# Altium schematic sheet SeptinaryAI_Balldi__elec_mother_board__mother_board_2023-07-21.schdoc
size 426 x 288 mm
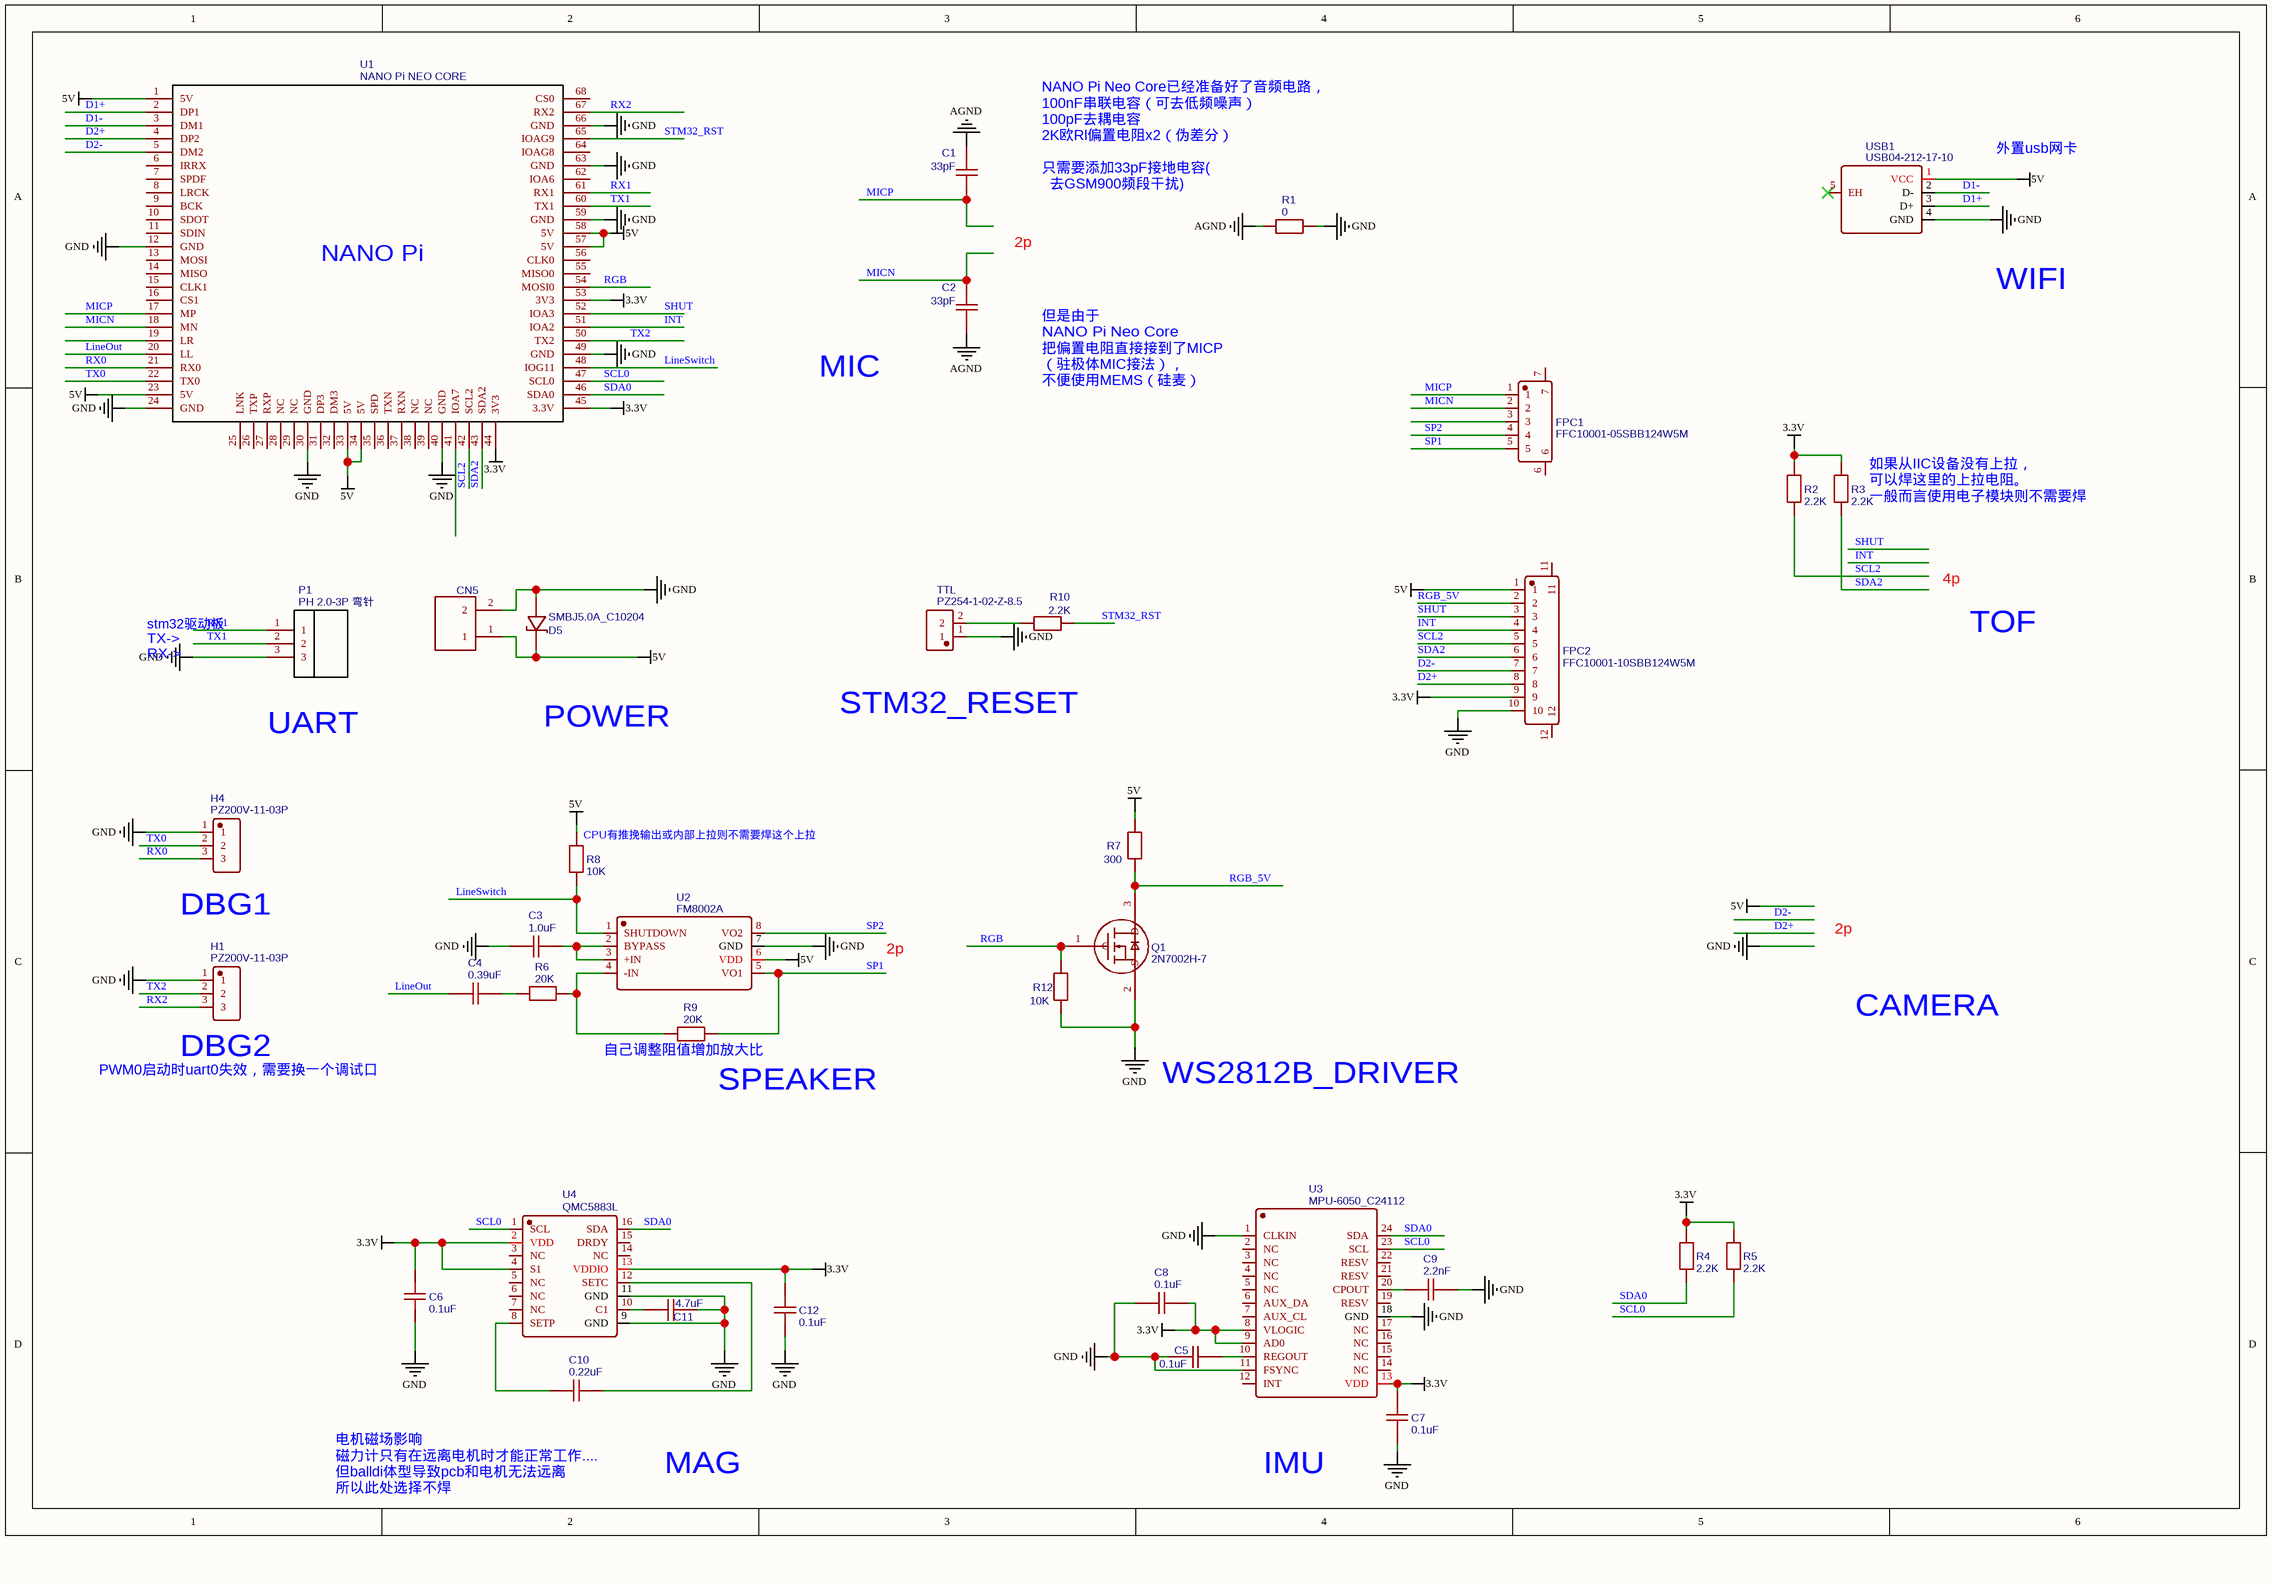
[diagram p0: SeptinaryAI_Balldi__elec_mother_board__mother_board_2023-07-21.schdoc]

## Parts
C1  33pF  [C0603]
C2  33pF  [C0603]
C3  1.0uF  [C0603]
C4  0.39uF  [C0603]
C5  0.1uF  [C0603]
C6  0.1uF  [C0603]
C7  0.1uF  [C0603]
C8  0.1uF  [C0603]
C9  2.2nF  [C0603]
C10  0.22uF  [C0603]
C11  4.7uF  [C0603]
C12  0.1uF  [C0603]
CN5  640454-2  [CONN-TH_640454-2]  (value not drawn)
D5  SMBJ5.0A_C10204  [SMB_L4.6-W3.6-LS5.3-R-RD]
FPC1  FFC10001-05SBB124W5M  [FFC-SMD_FFC10001-05SBB124W5M]
FPC2  FFC10001-10SBB124W5M  [FFC-SMD_FFC10001-10SBB124W5M]
H1  PZ200V-11-03P  [HDR-TH_3P-P2.00-V-M]
H4  PZ200V-11-03P  [HDR-TH_3P-P2.00-V-M]
P1  PH 2.0-3P 弯针  [PH 2.0-3P]
Q1  2N7002H-7  [SOT-23_L2.9-W1.3-P1.90-LS2.4-BR]
R1  0  [MY_R0603]
R2  2.2K  [MY_R0603]
R3  2.2K  [MY_R0603]
R4  2.2K  [MY_R0603]
R5  2.2K  [MY_R0603]
R6  20K  [MY_R0603]
R7  300  [MY_R0603]
R8  10K  [MY_R0603]
R9  20K  [MY_R0603]
R10  2.2K  [MY_R0603]
R12  10K  [MY_R0603]
TTL  PZ254-1-02-Z-8.5  [HDR-TH_2P-P2.54-V-M]
U1  NANO Pi NEO CORE  [NANO_PI_MOD]
U2  FM8002A  [SOP-8_L4.9-W3.9-P1.27-LS6.0-BL]
U3  MPU-6050_C24112  [LGA-24_L4.0-W4.0-P0.50-BL]
U4  QMC5883L  [MY_LGA-16_L3.0-W3.0-P0.50-BL_SQ]
USB1  USB04-212-17-10  [USB-A-TH_USB04-212-17-10B]

## Nets
3.3V: C6.1 C7.1 C8.2 C12.1 FPC2.9 R2.1 R3.1 R4.1 R5.1 U1.44(3V3) U1.45(3.3V) U1.53(3V3) U3.8(VLOGIC) U3.9(AD0) U3.13(VDD) U4.2(VDD) U4.4(S1) U4.13(VDDIO)
5V: CN5.1 D5.2(K) FPC2.1 R7.1 R8.2 U1.1(5V) U1.23(5V) U1.33(5V) U1.34(5V) U1.57(5V) U1.58(5V) U2.6(VDD) USB1.1(VCC)
AGND: C1.2 C2.1 R1.1
GND: C3.2 C5.2 C6.2 C7.2 C8.1 C9.2 C11.2 C12.2 CN5.2 D5.1(A) FPC2.10 H1.1 H4.1 P1.3 Q1.2(S) R1.2 R12.2 TTL.1 U1.12(GND) U1.24(GND) U1.30(GND) U1.40(GND) U1.49(GND) U1.59(GND) U1.63(GND) U1.66(GND) U2.7(GND) U3.1(CLKIN) U3.11(FSYNC) U3.18(GND) U4.9(GND) U4.11(GND) USB1.4(GND)
D1+: U1.2(DP1) USB1.3(D+)
D1-: U1.3(DM1) USB1.2(D-)
D2+: FPC2.8 U1.4(DP2)
D2-: FPC2.7 U1.5(DM2)
INT: FPC2.4 U1.51(IOA2)
LineOut: C4.2 U1.20(LL)
LineSwitch: R8.1 U1.48(IOG11) U2.1(SHUTDOWN)
MICN: C2.2 FPC1.2 U1.18(MN)
MICP: C1.1 FPC1.1 U1.17(MP)
RGB: Q1.1(G) R12.1 U1.54(MOSI0)
RGB_5V: FPC2.2 Q1.3(D) R7.2
RX0: H4.3 U1.21(RX0)
RX1: P1.1 U1.61(RX1)
RX2: H1.3 U1.67(RX2)
SCL0: R5.2 U1.47(SCL0) U3.23(SCL) U4.1(SCL)
SCL2: FPC2.5 R2.2 U1.42(SCL2)
SDA0: R4.2 U1.46(SDA0) U3.24(SDA) U4.16(SDA)
SDA2: FPC2.6 R3.2 U1.43(SDA2)
SHUT: FPC2.3 U1.52(IOA3)
SP1: FPC1.5 R9.2 U2.5(VO1)
SP2: FPC1.4 U2.8(VO2)
STM32_RST: R10.2 U1.65(IOAG9)
TX0: H4.2 U1.22(TX0)
TX1: P1.2 U1.60(TX1)
TX2: H1.2 U1.50(TX2)
NetC3_1: C3.1 U2.2(BYPASS) U2.3(+IN)
NetC4_1: C4.1 R6.1
NetC5_1: C5.1 U3.10(REGOUT)
NetC9_1: C9.1 U3.20(CPOUT)
NetC10_1: C10.1 U4.8(SETP)
NetC10_2: C10.2 U4.12(SETC)
NetC11_1: C11.1 U4.10(C1)
NetR6_2: R6.2 R9.1 U2.4(-IN)
NetR10_1: R10.1 TTL.2

Not connected (* = marked no-connect by the designer): FPC1 3 6 7; FPC2 11 12; U1 6(IRRX) 7(SPDF) 8(LRCK) 9(BCK) 10(SDOT) 11(SDIN) 13(MOSI) 14(MISO) 15(CLK1) 16(CS1) 19(LR) 25(LNK) 26(TXP) 27(RXP) 28(NC) 29(NC) 31(DP3) 32(DM3) 35(SPD) 36(TXN) 37(RXN) 38(NC) 39(NC) 41(IOA7) 55(MISO0) 56(CLK0) 62(IOA6) 64(IOAG8) 68(CS0); U3 2(NC) 3(NC) 4(NC) 5(NC) 6(AUX_DA) 7(AUX_CL) 12(INT) 14(NC) 15(NC) 16(NC) 17(NC) 19(RESV) 21(RESV) 22(RESV); U4 3(NC) 5(NC) 6(NC) 7(NC) 14(NC) 15(DRDY); USB1 5(EH)*

## Notes on the sheet
- NANO Pi Neo Core已经准备好了音频电路，
  100nF串联电容（可去低频噪声）
  100pF去耦电容
  2K欧Rl偏置电阻x2（伪差分）
  只需要添加33pF接地电容(
  去GSM900频段干扰)
- 外置usb网卡
- 2p
- 但是由于
  NANO Pi Neo Core
  把偏置电阻直接接到了MICP
  （驻极体MIC接法），
  不便使用MEMS（硅麦）
- WIFI
- MIC
- (near R3) 如果从IIC设备没有上拉，
  可以焊这里的上拉电阻。
  一般而言使用电子模块则不需要焊
- (near P1) stm32驱动板
  TX->
  RX->
- 4p
- TOF
- (near P1) UART
- POWER
- STM32_RESET
- (near R8) CPU有推挽输出或内部上拉则不需要焊这个上拉
- (near H4) DBG1
- CAMERA
- PWM0启动时uart0失效，需要换一个调试口
- (near H1) DBG2
- (near R9) 自己调整阻值增加放大比
- WS2812B_DRIVER
- (near R9) SPEAKER
- 电机磁场影响
  磁力计只有在远离电机时才能正常工作....
  但balldi体型导致pcb和电机无法远离
  所以此处选择不焊
- MAG
- IMU
- (in symbol NANO Pi NEO CORE) NANO Pi

## Library data of the parts
C1 C2 = 33pF: BOM_Manufacturer: SAMSUNG(三星); BOM_Manufacturer Part: CL10F104ZO8NNNC; nameAlias: Capacitance; Contributor: LCSC; BOM_Supplier Part: C2762283; spicePre: C; spiceSymbolName: CL10F104ZO8NNNC
C3 = 1.0uF: BOM_Manufacturer: SAMSUNG(三星); BOM_Manufacturer Part: CL10F104ZO8NNNC; nameAlias: Capacitance; Contributor: LCSC; BOM_Supplier Part: C2762283; spicePre: C; spiceSymbolName: CL10F104ZO8NNNC
C4 = 0.39uF: BOM_Manufacturer: SAMSUNG(三星); BOM_Manufacturer Part: CL10F104ZO8NNNC; nameAlias: Capacitance; Contributor: LCSC; BOM_Supplier Part: C2762283; spicePre: C; spiceSymbolName: CL10F104ZO8NNNC
C5-C8 C12 = 0.1uF: BOM_Manufacturer: SAMSUNG(三星); BOM_Manufacturer Part: CL10F104ZO8NNNC; nameAlias: Capacitance; Contributor: LCSC; BOM_Supplier Part: C2762283; spicePre: C; spiceSymbolName: CL10F104ZO8NNNC
C9 = 2.2nF: BOM_Manufacturer: SAMSUNG(三星); BOM_Manufacturer Part: CL10F104ZO8NNNC; nameAlias: Capacitance; Contributor: LCSC; BOM_Supplier Part: C2762283; spicePre: C; spiceSymbolName: CL10F104ZO8NNNC
C10 = 0.22uF: BOM_Manufacturer: SAMSUNG(三星); BOM_Manufacturer Part: CL10F104ZO8NNNC; nameAlias: Capacitance; Contributor: LCSC; BOM_Supplier Part: C2762283; spicePre: C; spiceSymbolName: CL10F104ZO8NNNC
C11 = 4.7uF: BOM_Manufacturer: SAMSUNG(三星); BOM_Manufacturer Part: CL10F104ZO8NNNC; nameAlias: Capacitance; Contributor: LCSC; BOM_Supplier Part: C2762283; spicePre: C; spiceSymbolName: CL10F104ZO8NNNC
CN5 = 640454-2: BOM_Manufacturer: TE Connectivity; BOM_Manufacturer Part: 640454-2; BOM_Supplier Part: C86501; spicePre: C; spiceSymbolName: 640454-2
D5 = SMBJ5.0A_C10204: BOM_Manufacturer: RUILON; BOM_Manufacturer Part: SMBJ5.0A; BOM_Supplier Part: C10204; spicePre: D; spiceSymbolName: SMBJ5.0A_C10204
FPC1 = FFC10001-05SBB124W5M: BOM_Manufacturer: TXGA(特思嘉); Contributor: LCSC; BOM_Supplier Part: C2833987; BOM_Manufacturer Part: FFC10001-05SBB124W5M; spicePre: F; spiceSymbolName: FFC10001-05SBB124W5M
FPC2 = FFC10001-10SBB124W5M: BOM_Manufacturer: TXGA; Contributor: LCSC; BOM_Supplier Part: C456461; BOM_Manufacturer Part: FFC10001-10SBB124W5M; spicePre: F; spiceSymbolName: FFC10001-10SBB124W5M
H1 H4 = PZ200V-11-03P: BOM_Manufacturer: XFCN; Contributor: LCSC; BOM_Supplier Part: C541857; BOM_Manufacturer Part: PZ200V-11-03P; spicePre: H; spiceSymbolName: PZ200V-11-03P
P1 = PH 2.0-3P 弯针: Contributor: 584992092; BOM_Manufacturer Part: PH 2.0-3P; spicePre: P; spiceSymbolName: PH 2.0-3P 弯针
Q1 = 2N7002H-7: BOM_Manufacturer: DIODES; Contributor: LCSC; BOM_Manufacturer Part: 2N7002H-7; BOM_Supplier Part: C150714; spicePre: Q; spiceSymbolName: 2N7002H-7
R1 = 0: BOM_Manufacturer: VISHAY(威世); BOM_Manufacturer Part: TNPW0603130RBEEA; nameAlias: Resistance; Contributor: LCSC; BOM_Supplier Part: C1870287; spicePre: R; spiceSymbolName: TNPW0603130RBEEA
R2-R5 R10 = 2.2K: BOM_Manufacturer: VISHAY(威世); BOM_Manufacturer Part: TNPW0603130RBEEA; nameAlias: Resistance; Contributor: LCSC; BOM_Supplier Part: C1870287; spicePre: R; spiceSymbolName: TNPW0603130RBEEA
R6 R9 = 20K: BOM_Manufacturer: VISHAY(威世); BOM_Manufacturer Part: TNPW0603130RBEEA; nameAlias: Resistance; Contributor: LCSC; BOM_Supplier Part: C1870287; spicePre: R; spiceSymbolName: TNPW0603130RBEEA
R7 = 300: BOM_Manufacturer: VISHAY(威世); BOM_Manufacturer Part: TNPW0603130RBEEA; nameAlias: Resistance; Contributor: LCSC; BOM_Supplier Part: C1870287; spicePre: R; spiceSymbolName: TNPW0603130RBEEA
R8 R12 = 10K: BOM_Manufacturer: VISHAY(威世); BOM_Manufacturer Part: TNPW0603130RBEEA; nameAlias: Resistance; Contributor: LCSC; BOM_Supplier Part: C1870287; spicePre: R; spiceSymbolName: TNPW0603130RBEEA
TTL = PZ254-1-02-Z-8.5: BOM_Manufacturer: HCTL(华灿天禄); Contributor: jiutianlanyue; BOM_Supplier: LCSC; BOM_Supplier Part: C2894925; BOM_Manufacturer Part: PZ254-1-02-Z-8.5; spicePre: H; spiceSymbolName: PZ254-1-02-Z-8.5
U1 = NANO Pi NEO CORE: Contributor: sepai; Package Display: No; spicePre: U; spiceSymbolName: NANO_PI_MOD
U2 = FM8002A: BOM_Manufacturer: FM; BOM_Manufacturer Part: FM8002A; BOM_Supplier Part: C94625; spicePre: U; spiceSymbolName: FM8002A
U3 = MPU-6050_C24112: BOM_Manufacturer: InvenSense; sourceId: 1T5FDZYC8; timeStamp: 1462265206; BOM_Manufacturer Part: MPU-6050; BOM_Supplier Part: C24112; spicePre: U; spiceSymbolName: MPU-6050_C24112
U4 = QMC5883L: BOM_Manufacturer: QST(上海矽睿); Contributor: LCSC; BOM_Supplier: LCSC; BOM_Supplier Part: C976032; BOM_Manufacturer Part: QMC5883L; BOM_JLCPCB Part Class: Extended Part; spicePre: U; spiceSymbolName: QMC5883L
USB1 = USB04-212-17-10: BOM_Manufacturer: JINJIA; Contributor: LCSC; BOM_Supplier Part: C718030; BOM_Manufacturer Part: USB04-212-17-10; spicePre: U; spiceSymbolName: USB04-212-17-10